# Altium project SysP18_Robi.PrjPcb
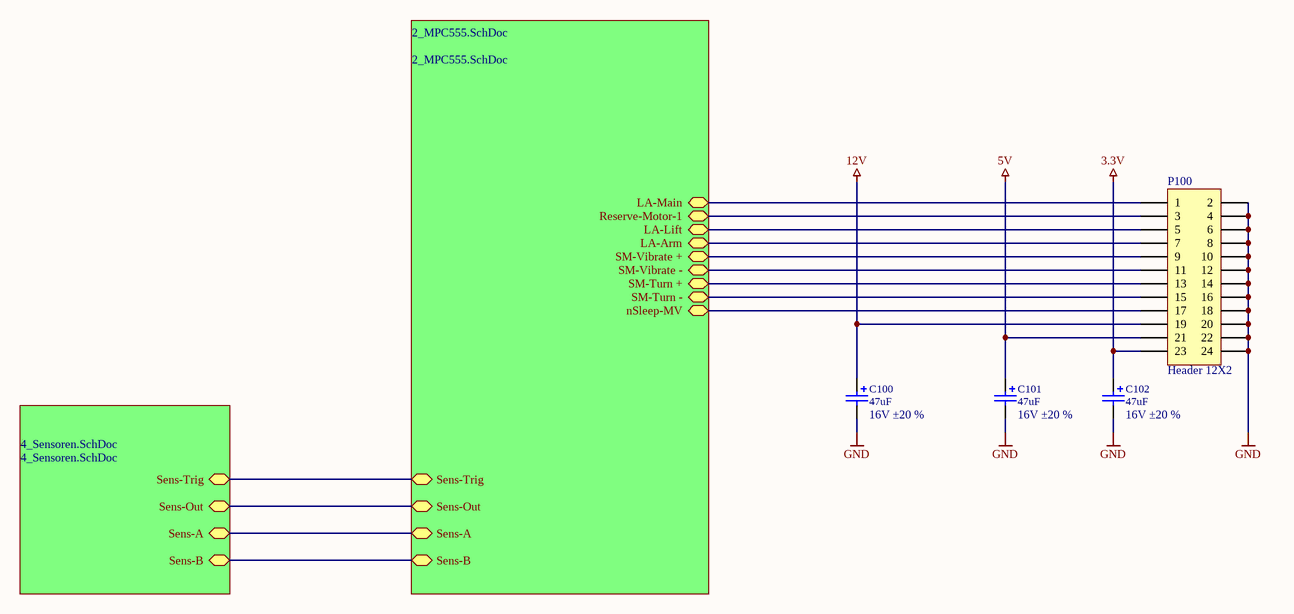
[diagram p0: TopSheet.schdoc]
3 sheets, 66 parts. Net scope: hierarchical (ports join the sheet entries above them; power ports are global).
Board file: SensorenUndMPC555.PcbDoc
Sheets:
  TopSheet.schdoc
    2_MPC555.SchDoc = 2_MPC555.SchDoc
    4_Sensoren.SchDoc = 4_Sensoren.SchDoc

## Sheet TopSheet.schdoc: Top Sheet und Verbindungstecker für Motoerntreiber
size A4; Organization1: Sciences of Technology Buchs; Size: A4

### Parts
C100  value 47uF  ValueAddon: 16V ±20 %  [CDE_CAP AVE CODE D_H]  (hidden comment: AVE476M16D16T-F)
C101  value 47uF  ValueAddon: 16V ±20 %  [CDE_CAP AVE CODE D_H]  (hidden comment: AVE476M16D16T-F)
C102  value 47uF  ValueAddon: 16V ±20 %  [CDE_CAP AVE CODE D_H]  (hidden comment: AVE476M16D16T-F)
P100  Header 12X2  [HDR2X12]

### Sub-sheets
2_MPC555.SchDoc = 2_MPC555.SchDoc: Sens-Trig, Sens-Out, Sens-A, Sens-B, LA-Main, Reserve-Motor-1, LA-Lift, LA-Arm, SM-Vibrate +, SM-Vibrate -, SM-Turn +, SM-Turn -, nSleep-MV
4_Sensoren.SchDoc = 4_Sensoren.SchDoc: Sens-Trig, Sens-Out, Sens-A, Sens-B

### Nets
3.3V: C102.1(Pos) P100.23
5V: C101.1(Pos) P100.21
12V: C100.1(Pos) P100.19
GND: C100.2(Neg) C101.2(Neg) C102.2(Neg) P100.2 P100.4 P100.6 P100.8 P100.10 P100.12 P100.14 P100.16 P100.18 P100.20 P100.22 P100.24
NetC402_1: sheet 2_MPC555.SchDoc/Sens-Trig, sheet 4_Sensoren.SchDoc/Sens-Trig
NetJ1_3: P100.1 ; sheet 2_MPC555.SchDoc/LA-Main
NetJ1_4: P100.13 ; sheet 2_MPC555.SchDoc/SM-Turn +
NetJ1_5: P100.15 ; sheet 2_MPC555.SchDoc/SM-Turn -
NetJ1_6: P100.5 ; sheet 2_MPC555.SchDoc/LA-Lift
NetJ1_7: P100.7 ; sheet 2_MPC555.SchDoc/LA-Arm
NetJ1_8: P100.9 ; sheet 2_MPC555.SchDoc/SM-Vibrate +
NetJ1_9: P100.11 ; sheet 2_MPC555.SchDoc/SM-Vibrate -
NetJ1_11: P100.3 ; sheet 2_MPC555.SchDoc/Reserve-Motor-1
NetJ1_35: sheet 2_MPC555.SchDoc/Sens-Out, sheet 4_Sensoren.SchDoc/Sens-Out
NetJ1_61: P100.17 ; sheet 2_MPC555.SchDoc/nSleep-MV
NetJ1_80: sheet 2_MPC555.SchDoc/Sens-A, sheet 4_Sensoren.SchDoc/Sens-A
NetJ1_81: sheet 2_MPC555.SchDoc/Sens-B, sheet 4_Sensoren.SchDoc/Sens-B

### Notes on the sheet
- Title:
- Description:
- Size:
- Date:
- Name:
- Number:
- Time:
- Revision:
- Sheet
- Checked:
- of
- File:

### Library data of the parts
C100-C102 = ELKO 47uF 16V: ELKO, 47uF, 16V, CDE_AVE476M16D16T-F_AVE CODE D; Manufacturer: Cornell Dubilier; #Class: PASSIVE; #ClassSub: CAPACITOR; RefFootprint: CDE_CAP AVE CODE D; Distributor PartNr: 598-AVE476M16D16T-F; Distributor: Mouser; Published: 20121220; Publisher: Stefan Ursella, M.Eng; ComponentLink1Description: Manufacturer Link; ComponentLink2Description: Datasheet; ComponentLink2URL: http://www.cde.com/catalogs/AVE.pdf; ComponentLink3Description: Packaging Specification; Manufacturer PartNr: AVE476M16D16T-F; RefFileFOO: *; RefFileSCH: *; RefSchema: CDE_AVE476M16D16T-F_AVE CODE D; ClassName: Connect_Full
P100 = Header 12X2: Header, 12-Pin, Dual row; LatestRevisionDate: 17-Jul-2002; LatestRevisionNote: Re-released for DXP Platform.; Publisher: Altium Limited

## Sheet 2_MPC555.SchDoc: Schema MPC 555 und Diverses
size A4; CheckedBy: Falk Kyburz; Author: Luzian Weber; Organization1: Sciences of Technology Buchs; Size: A4
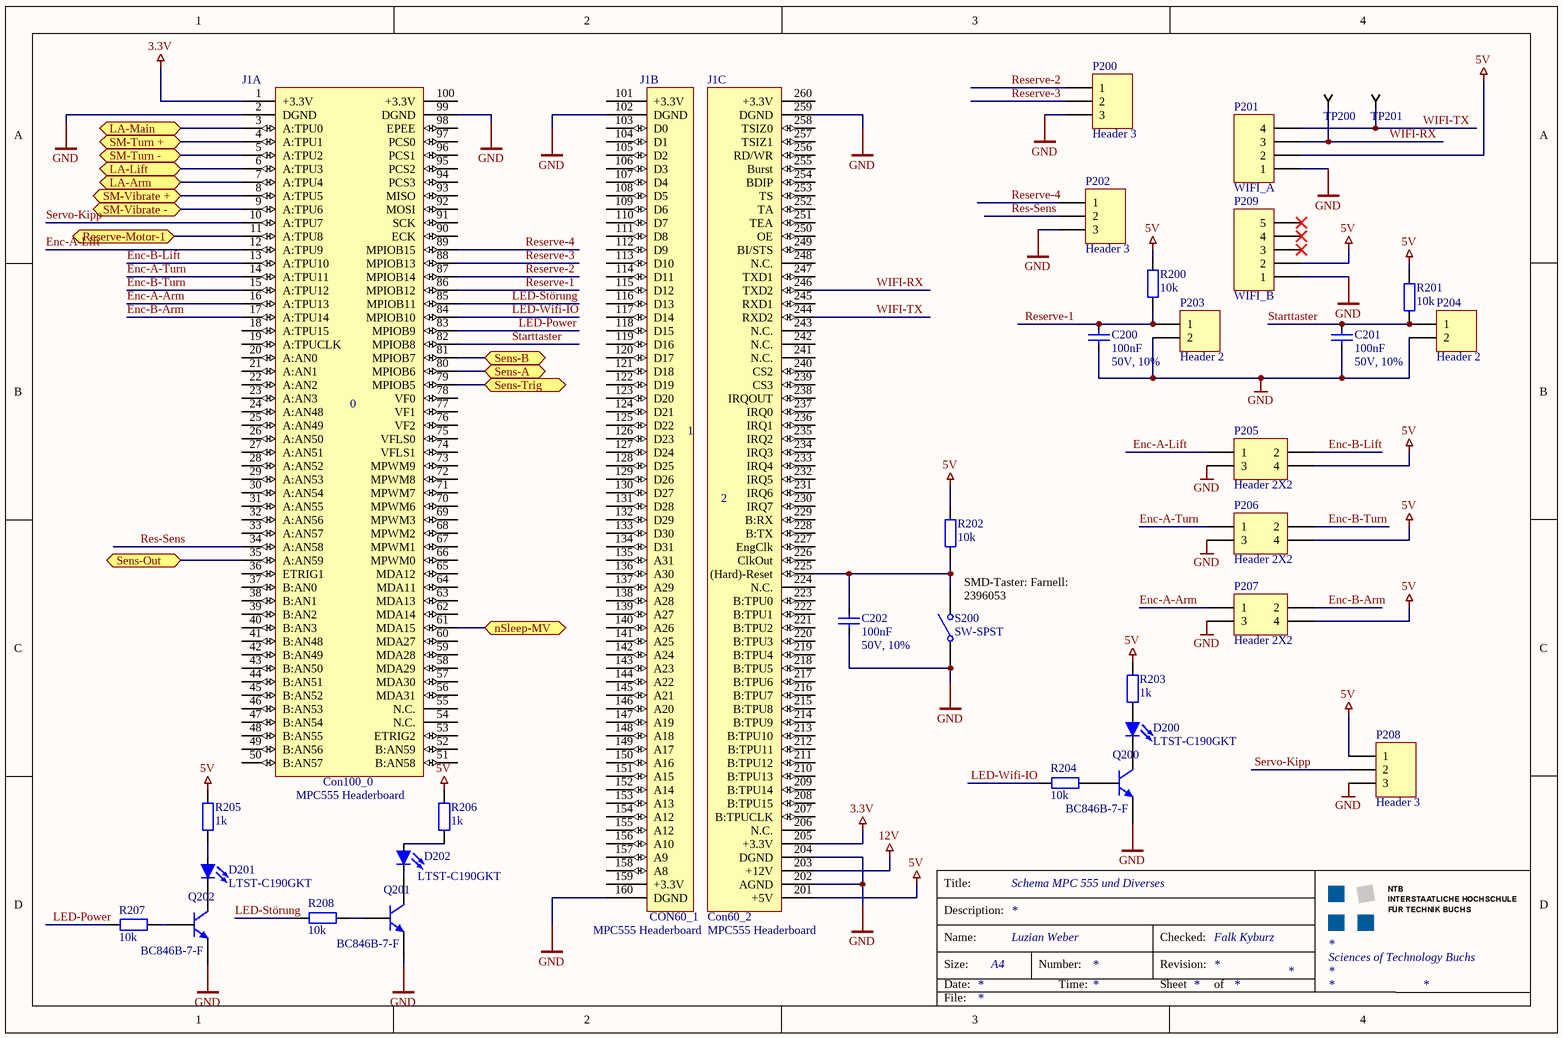
[diagram p1: 2_MPC555.SchDoc]

### Parts
C200  100nF  ValAddon: 50V, 10%  [CAP-0805[2012]]
C201  100nF  ValAddon: 50V, 10%  [CAP-0805[2012]]
C202  100nF  ValAddon: 50V, 10%  [CAP-0805[2012]]
D200  LTST-C190GKT  [LED 0603 green]
D201  LTST-C190GKT  [LED 0603 green]
D202  LTST-C190GKT  [LED 0603 green]
J1  MPC555 Headerboard  [MPC555 Headerboard THT]  (parts A,B,C of 3)
P200  Header 3  [HDR1X3]
P201  WIFI_A  [HDR1X4]
P202  Header 3  [HDR1X3]
P203  Header 2  [HDR1X2]
P204  Header 2  [HDR1X2]
P205  Header 2X2  [HDR2X2]
P206  Header 2X2  [HDR2X2]
P207  Header 2X2  [HDR2X2]
P208  Header 3  [HDR1X3]
P209  WIFI_B  [HDR1X5]
Q200  BC846B-7-F  [SOT-23]
Q201  BC846B-7-F  [SOT-23]
Q202  BC846B-7-F  [SOT-23]
R200  10k  [RES-0805[2012]]
R201  10k  [RES-0805[2012]]
R202  10k  [RES-0805[2012]]
R203  1k  [RES-0805[2012]]
R204  10k  [RES-0805[2012]]
R205  1k  [RES-0805[2012]]
R206  1k  [RES-0805[2012]]
R207  10k  [RES-0805[2012]]
R208  10k  [RES-0805[2012]]
S200  SW-SPST  [B3SE-1002P]
TP200  Testpoint SMD 1206  [TP-SMD-1206]  (value not drawn)  (no BOM)
TP201  Testpoint SMD 1206  [TP-SMD-1206]  (value not drawn)  (no BOM)

### Ports
LA-Arm, LA-Lift, LA-Main, nSleep-MV, Reserve-Motor-1, Sens-A, Sens-B, Sens-Out, Sens-Trig, SM-Turn +, SM-Turn -, SM-Vibrate +, SM-Vibrate -

### Nets
3.3V: J1.1(+3.3V) J1.205(+3.3V)
5V: J1.201(+5V) P201.2 P205.4 P206.4 P207.4 P208.1 P209.2 R200.2 R201.2 R202.2 R203.2 R205.2 R206.2
12V: J1.203(+12V)
GND: C200.1(Pos) C201.1(Pos) C202.1(Pos) J1.2(DGND) J1.99(DGND) J1.102(DGND) J1.160(DGND) J1.202(AGND) J1.204(DGND) J1.259(DGND) P200.3 P201.1 P202.3 P203.2 P204.2 P205.3 P206.3 P207.3 P208.3 P209.1 Q200.2(E) Q201.2(E) Q202.2(E) S200.1(COMMON)
Enc-A-Arm: J1.16(A:TPU13) P207.1
Enc-A-Lift: J1.12(A:TPU9) P205.1
Enc-A-Turn: J1.14(A:TPU11) P206.1
Enc-B-Arm: J1.17(A:TPU14) P207.2
Enc-B-Lift: J1.13(A:TPU10) P205.2
Enc-B-Turn: J1.15(A:TPU12) P206.2
LED-Power: J1.83(MPIOB9) R207.1
LED-Störung: J1.85(MPIOB11) R208.1
LED-Wifi-IO: J1.84(MPIOB10) R204.1
Res-Sens: J1.34(A:AN58) P202.2
Reserve-1: C200.2(Neg) J1.86(MPIOB12) P203.1 R200.1
Reserve-2: J1.87(MPIOB14) P200.1
Reserve-3: J1.88(MPIOB13) P200.2
Reserve-4: J1.89(MPIOB15) P202.1
Servo-Kipp: J1.10(A:TPU7) P208.2
Starttaster: C201.2(Neg) J1.82(MPIOB8) P204.1 R201.1
WIFI-RX: J1.246(TXD2) P201.3 TP200.1
WIFI-TX: J1.244(RXD2) P201.4 TP201.1
NetC202_2: C202.2(Neg) J1.225((Hard)-Reset) R202.1 S200.2(NO)
NetC402_1: J1.79(MPIOB5) ; port Sens-Trig
NetD200_1: D200.1(K) Q200.3(C)
NetD200_2: D200.2(A) R203.1
NetD201_1: D201.1(K) Q202.3(C)
NetD201_2: D201.2(A) R205.1
NetD202_1: D202.1(K) Q201.3(C)
NetD202_2: D202.2(A) R206.1
NetJ1_3: J1.3(A:TPU0) ; port LA-Main
NetJ1_4: J1.4(A:TPU1) ; port SM-Turn +
NetJ1_5: J1.5(A:TPU2) ; port SM-Turn -
NetJ1_6: J1.6(A:TPU3) ; port LA-Lift
NetJ1_7: J1.7(A:TPU4) ; port LA-Arm
NetJ1_8: J1.8(A:TPU5) ; port SM-Vibrate +
NetJ1_9: J1.9(A:TPU6) ; port SM-Vibrate -
NetJ1_11: J1.11(A:TPU8) ; port Reserve-Motor-1
NetJ1_35: J1.35(A:AN59) ; port Sens-Out
NetJ1_61: J1.61(MDA15) ; port nSleep-MV
NetJ1_80: J1.80(MPIOB6) ; port Sens-A
NetJ1_81: J1.81(MPIOB7) ; port Sens-B
NetQ200_1: Q200.1(B) R204.2
NetQ201_1: Q201.1(B) R208.2
NetQ202_1: Q202.1(B) R207.2

Not connected (* = marked no-connect by the designer): J1 18(A:TPU15) 19(A:TPUCLK) 20(A:AN0) 21(A:AN1) 22(A:AN2) 23(A:AN3) 24(A:AN48) 25(A:AN49) 26(A:AN50) 27(A:AN51) 28(A:AN52) 29(A:AN53) 30(A:AN54) 31(A:AN55) 32(A:AN56) 33(A:AN57) 36(ETRIG1) 37(B:AN0) 38(B:AN1) 39(B:AN2) 40(B:AN3) 41(B:AN48) 42(B:AN49) 43(B:AN50) 44(B:AN51) 45(B:AN52) 46(B:AN53) 47(B:AN54) 48(B:AN55) 49(B:AN56) 50(B:AN57) 51(B:AN58) 52(B:AN59) 53(ETRIG2) 54(N.C.) 55(N.C.) 56(MDA31) 57(MDA30) 58(MDA29) 59(MDA28) 60(MDA27) 62(MDA14) 63(MDA13) 64(MDA11) 65(MDA12) 66(MPWM0) 67(MPWM1) 68(MPWM2) 69(MPWM3) 70(MPWM6) 71(MPWM7) 72(MPWM8) 73(MPWM9) 74(VFLS1) 75(VFLS0) 76(VF2) 77(VF1) 78(VF0) 90(ECK) 91(SCK) 92(MOSI) 93(MISO) 94(PCS3) 95(PCS2) 96(PCS1) 97(PCS0) 98(EPEE) 100(+3.3V) 101(+3.3V) 103(D0) 104(D1) 105(D2) 106(D3) 107(D4) 108(D5) 109(D6) 110(D7) 111(D8) 112(D9) 113(D10) 114(D11) 115(D12) 116(D13) 117(D14) 118(D15) 119(D16) 120(D17) 121(D18) 122(D19) 123(D20) 124(D21) 125(D22) 126(D23) 127(D24) 128(D25) 129(D26) 130(D27) 131(D28) 132(D29) 133(D30) 134(D31) 135(A31) 136(A30) 137(A29) 138(A28) 139(A27) 140(A26) 141(A25) 142(A24) 143(A23) 144(A22) 145(A21) 146(A20) 147(A19) 148(A18) 149(A17) 150(A16) 151(A15) 152(A14) 153(A13) 154(A12) 155(A12) 156(A10) 157(A9) 158(A8) 159(+3.3V) 206(N.C.) 207(B:TPUCLK) 208(B:TPU15) 209(B:TPU14) 210(B:TPU13) 211(B:TPU12) 212(B:TPU11) 213(B:TPU10) 214(B:TPU9) 215(B:TPU8) 216(B:TPU7) 217(B:TPU6) 218(B:TPU5) 219(B:TPU4) 220(B:TPU3) 221(B:TPU2) 222(B:TPU1) 223(B:TPU0) 224(N.C.) 226(ClkOut) 227(EngClk) 228(B:TX) 229(B:RX) 230(IRQ7) 231(IRQ6) 232(IRQ5) 233(IRQ4) 234(IRQ3) 235(IRQ2) 236(IRQ1) 237(IRQ0) 238(IRQOUT) 239(CS3) 240(CS2) 241(N.C.) 242(N.C.) 243(N.C.) 245(RXD1) 247(TXD1) 248(N.C.) 249(BI/STS) 250(OE) 251(TEA) 252(TA) 253(TS) 254(BDIP) 255(Burst) 256(RD/WR) 257(TSIZ1) 258(TSIZ0) 260(+3.3V); P209 3* 4* 5*

### Notes on the sheet
- (near S200) SMD-Taster: Farnell: 2396053
- Title:
- Description:
- Size:
- Date:
- Name:
- Number:
- Time:
- Revision:
- Sheet
- Checked:
- of
- File:
- (in symbol MPC555 Headerboard, part A) 0; Con100_0
- (in symbol MPC555 Headerboard, part B) CON60_1
- (in symbol MPC555 Headerboard, part C) Con60_2

### Library data of the parts
C200-C202 = MLCC 0805 100n 50V: 100n 50V X7R MLCC 0805 (1608 Metric); Tolerance: 10%; Case-EIA: 0803; Case-Metric: 2013; Rated Voltage: 50V; Temperature Characteristics EIA: X7R; Temperature Range EIA: -55C/+125C; Value: 100nF
D200-D202 = LED Green: LED SMD 0603 green 6mcd; Forward Current: 30mA; Forward Voltage: 2.1V; Spectrum: 565nm; Color: green; ComponentLink1Description: Datasheet LTST-C190GKT; ComponentLink1URL: V:\Diodes\Lite-On-LTST-C190GKT.pdf
J1 = MPC555 Headerboard: NTB MPC555 Headerboard
P200 P202 P208 = Header 3: Header, 3-Pin; LatestRevisionDate: 17-Jul-2002; LatestRevisionNote: Re-released for DXP Platform.; Publisher: Altium Limited
P201 = Header 4: Header, 4-Pin; LatestRevisionDate: 17-Jul-2002; LatestRevisionNote: Re-released for DXP Platform.; Publisher: Altium Limited
P203 P204 = Header 2: Header, 2-Pin; LatestRevisionDate: 17-Jul-2002; LatestRevisionNote: Re-released for DXP Platform.; Publisher: Altium Limited
P205-P207 = Header 2X2: Header, 2-Pin, Dual row; LatestRevisionDate: 17-Jul-2002; LatestRevisionNote: Re-released for DXP Platform.; Publisher: Altium Limited
P209 = Header 5: Header, 5-Pin; LatestRevisionDate: 17-Jul-2002; LatestRevisionNote: Re-released for DXP Platform.; Publisher: Altium Limited
Q200-Q202 = BC846B-SOT23: NPN General-purpose Transistor; Manufacturer: DIODES INC; #Class: SEMICONDUCTOR-TRANSISTOR; #ClassSub: BJT-NPN; RefFootprint: DIODS_SOT23_1B2E3C_3_H; RefSchema: DIODS_BC846B-7-F_SOT23; Published: 17-Sep-2003; Publisher: Altium Limited; ComponentLink1Description: Manufacturer Link; ComponentLink1URL: http://www.diodes.com/products/catalog/detail.php?item-id=6689&popup=datasheet; ComponentLink2Description: Datasheet; ComponentLink2URL: http://www.diodes.com/datasheets/ds11108.pdf; ComponentLink3Description: Packaging Specification; ComponentLink3URL: http://www.diodes.com/datasheets/ap02001.pdf; Distributor: Farnell; Manufacturer PartNr: BC846B-7-F; Distributor PartNr: 1773617; Status: nLager; RefFileFOO: *; RefFileSCH: *
R200-R208 = RES 0805: 0805 (2013 Metric) 1/10 W 10K 1 Thick Film Chip Resistor; Power: 1/10 W; Case-EIA: 0805; Case-Metric: 2013; Tolerance: 1%; Temp. Coefficent: ±100ppm; Technology: SMT; Value: 10k
S200 = SW-SPST: Single-Pole, Single-Throw Switch; Published: 24-Mar-1999; LatestRevisionDate: 17-Jul-2002; LatestRevisionNote: Re-released for DXP Platform.; PackageReference: SPST-2; Publisher: Altium Limited; PackageDescription: Switch; 2 Leads
TP200 TP201 = Testpoint SMD 1206: Testpoint xSmall; Type: Standard (No BOM)

## Sheet 4_Sensoren.SchDoc: Schema Sensoren
size A4; CheckedBy: Falk Kyburz; Author: Luzian Weber; Organization1: Sciences of Technology Buchs; Size: A4
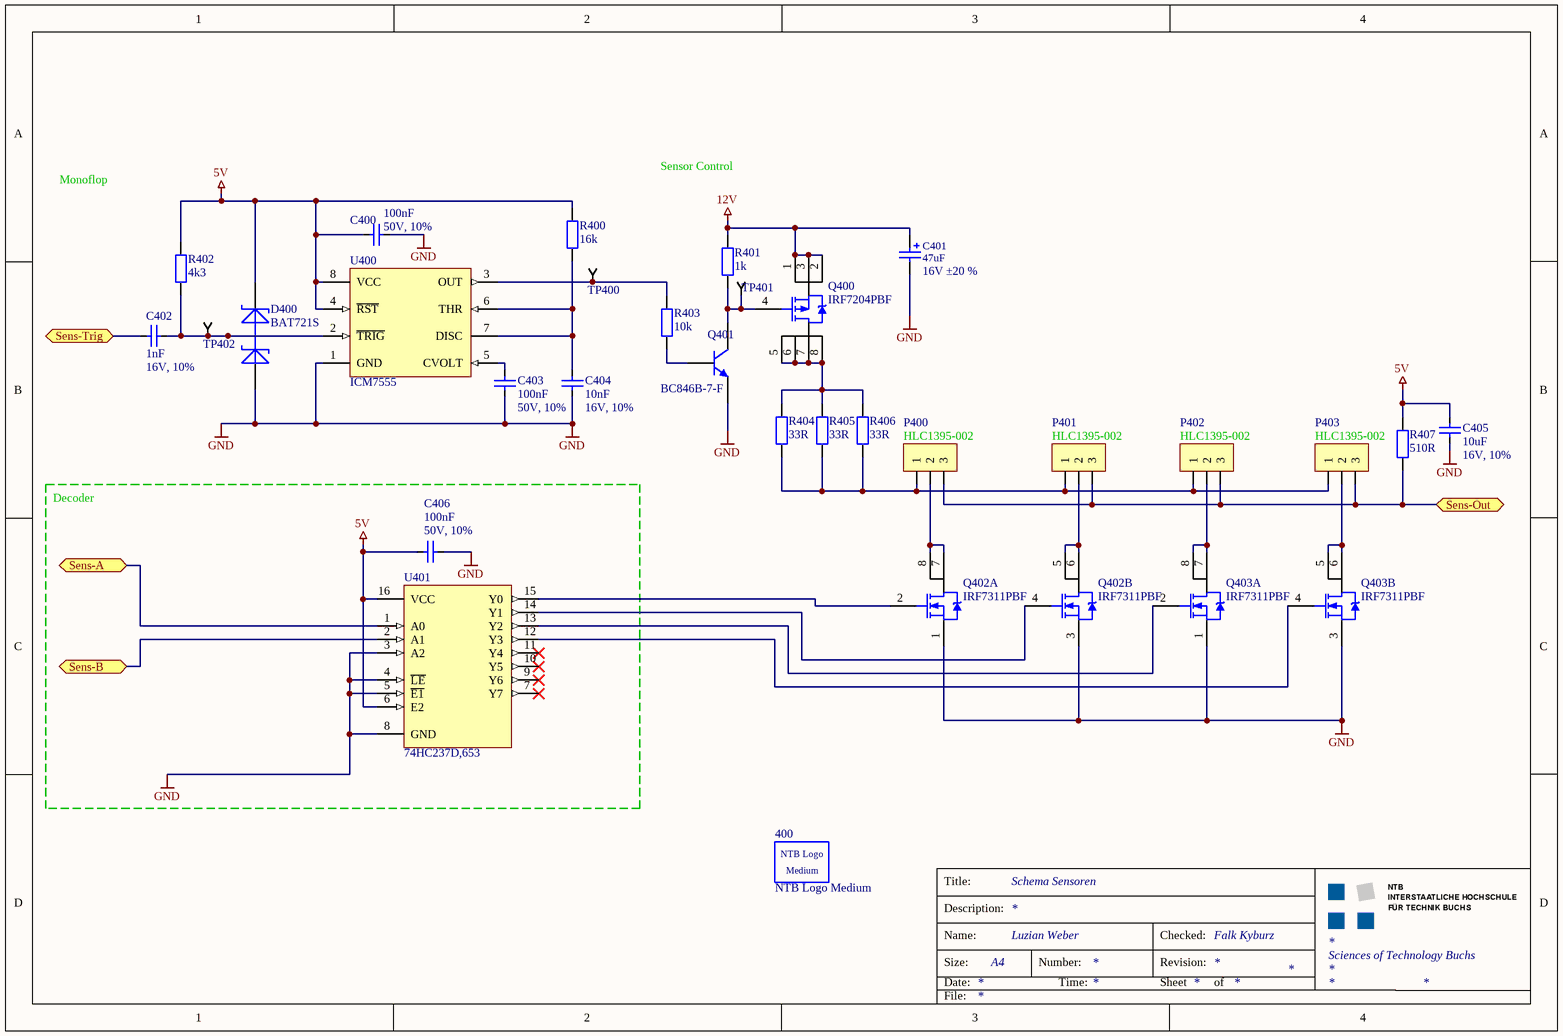
[diagram p2: 4_Sensoren.SchDoc]

### Parts
400  NTB Logo Medium  [NTB Logo Medium]
C400  100nF  ValAddon: 50V, 10%  [CAP-0805[2012]]
C401  value 47uF  ValueAddon: 16V ±20 %  [CDE_CAP AVE CODE D_H]  (hidden comment: AVE476M16D16T-F)
C402  1nF  ValueAddon: 16V, 10%  [CAP-0805[2012]]
C403  100nF  ValAddon: 50V, 10%  [CAP-0805[2012]]
C404  10nF  ValueAddon: 16V, 10%  [CAP-0805[2012]]
C405  10uF  ValAddon: 16V, 10%  [CAP-1206[3216]]
C406  100nF  ValAddon: 50V, 10%  [CAP-0805[2012]]
D400  BAT721S  [SOT-23]
P400  3 Pin Header Buchse  [3PIN HEADER SOCKET 2.54MM]  (value not drawn)
P401  3 Pin Header Buchse  [3PIN HEADER SOCKET 2.54MM]  (value not drawn)
P402  3 Pin Header Buchse  [3PIN HEADER SOCKET 2.54MM]  (value not drawn)
P403  3 Pin Header Buchse  [3PIN HEADER SOCKET 2.54MM]  (value not drawn)
Q400  IRF7204PBF  [SOIC-8]
Q401  BC846B-7-F  [SOT-23]
Q402  IRF7311PBF  [SOIC-8]  (parts A,B of 2)
Q403  IRF7311PBF  [SOIC-8]  (parts A,B of 2)
R400  16k  [RES-0805[2012]]
R401  1k  [RES-0805[2012]]
R402  4k3  [RES-0805[2012]]
R403  10k  [RES-0805[2012]]
R404  33R  [RES-0805[2012]]
R405  33R  [RES-0805[2012]]
R406  33R  [RES-0805[2012]]
R407  510R  [RES-0805[2012]]
TP400  Testpoint SMD 1206  [TP-SMD-1206]  (value not drawn)  (no BOM)
TP401  Testpoint SMD 1206  [TP-SMD-1206]  (value not drawn)  (no BOM)
TP402  Testpoint SMD 1206  [TP-SMD-1206]  (value not drawn)  (no BOM)
U400  ICM7555  [SOIC-8]
U401  74HC237D,653  [SOIC-16]

### Blocks framed on the sheet
Decoder: C406 U401

### Ports
Sens-A, Sens-B, Sens-Out, Sens-Trig

### Nets
5V: C400.1(Pos) C405.1(Pos) C406.1(Pos) D400.2(cathode2) R400.2 R402.2 R407.2 U400.4(~{RST}) U400.8(VCC) U401.6(E2) U401.16(VCC)
12V: C401.1(Pos) Q400.1(S) Q400.2(S) Q400.3(S) R401.2
GND: C400.2(Neg) C401.2(Neg) C403.2(Neg) C404.2(Neg) C405.2(Neg) C406.2(Neg) D400.1(Anode1) Q401.2(E) Q402.1(S) Q402.3(S) Q403.1(S) Q403.3(S) U400.1(GND) U401.3(A2) U401.4(~{LE}) U401.5(~{E1}) U401.8(GND)
NetC402_1: C402.1(Pos) ; port Sens-Trig
NetC402_2: C402.2(Neg) D400.3(Cathode1,_anode2) R402.1 TP402.1 U400.2(~{TRIG})
NetC403_1: C403.1(Pos) U400.5(CVOLT)
NetC404_1: C404.1(Pos) R400.1 U400.6(THR) U400.7(DISC)
NetJ1_35: P400.3 P401.3 P402.3 P403.3 R407.1 ; port Sens-Out
NetJ1_80: U401.1(A0) ; port Sens-A
NetJ1_81: U401.2(A1) ; port Sens-B
NetP400_1: P400.1 P401.1 P402.1 P403.1 R404.1 R405.1 R406.1
NetP400_2: P400.2 Q402.7(D) Q402.8(D)
NetP401_2: P401.2 Q402.5(D) Q402.6(D)
NetP402_2: P402.2 Q403.7(D) Q403.8(D)
NetP403_2: P403.2 Q403.5(D) Q403.6(D)
NetQ400_4: Q400.4(G) Q401.3(C) R401.1 TP401.1
NetQ400_5: Q400.5(D) Q400.6(D) Q400.7(D) Q400.8(D) R404.2 R405.2 R406.2
NetQ401_1: Q401.1(B) R403.2
NetQ402_2: Q402.2(G) U401.15(Y0)
NetQ402_4: Q402.4(G) U401.14(Y1)
NetQ403_2: Q403.2(G) U401.13(Y2)
NetQ403_4: Q403.4(G) U401.12(Y3)
NetR403_1: R403.1 TP400.1 U400.3(OUT)

Not connected (* = marked no-connect by the designer): U401 7(Y7)* 9(Y6)* 10(Y5)* 11(Y4)*

### Notes on the sheet
- Sensor Control
- Monoflop
- HLC1395-002
- (near P401) HLC1395-002
- (near P402) HLC1395-002
- Title:
- Description:
- Size:
- Date:
- Name:
- Number:
- Time:
- Revision:
- Sheet
- Checked:
- of
- File:
- (in symbol NTB Logo Medium) NTB Logo; Medium

### Library data of the parts
C400 C403 C406 = MLCC 0805 100n 50V: as C200 on sheet 2_MPC555; Rated Voltage: 50V; Temperature Characteristics EIA: X7R; Temperature Range EIA: -55C/+125C; Value: 100nF
C401 = ELKO 47uF 16V: as C100 on sheet TopSheet; Distributor PartNr: 598-AVE476M16D16T-F; Distributor: Mouser; Published: 20121220; Publisher: Stefan Ursella, M.Eng; ComponentLink1Description: Manufacturer Link; ComponentLink2Description: Datasheet; ComponentLink2URL: http://www.cde.com/catalogs/AVE.pdf; ComponentLink3Description: Packaging Specification; Manufacturer PartNr: AVE476M16D16T-F; RefFileFOO: *; RefFileSCH: *; RefSchema: CDE_AVE476M16D16T-F_AVE CODE D; ClassName: Connect_Full
C402 = MLCC 0805 1n 16V: MLCC - SMD/SMT 0805 1000pF 16V C0G 10%; Manufacturer: Vishay; Manufacturer PartNr: VJ0805A102KXJPW1BC; RefFootprint: Gen_0805_H; RefSchema: Cap_1nF; #Class: *; #SubClass: *; Published: 18.12.14; Publisher: SCLM; RefFileFOO: *; RefFileSCH: *; ComponentLink1Description: Manufacturer Link; ComponentLink1URL: http://www.vishay.com/product?docid=28548; ComponentLink2Description: Datasheet; ComponentLink2URL: http://www.vishay.com/docs/28548/vjw1bcbascomseries.pdf; Supplier 1: Mouser; Supplier Part Number 1: 77-VJ0805A102KXJPBC; Status: Lager?; Value: 1nF
C404 = MLCC 0805 10n 16V: 10n 16V X7R MLCC 0805; Manufacturer: AVX; Manufacturer PartNr: 0805YC103KAT2A; #Class: *; #SubClass: *; Published: 09.01.15; Publisher: SCLM; RefFootprint: *; RefFileFOO: *; RefFileSCH: *; RefSchema: *; ComponentLink1Description: Manufacturer Link; ComponentLink1URL: http://www.avx.com/prodinfo_productdetail.asp?I=45&K=search&C=&word=0805YC103KAT2A&form=number&Number=; ComponentLink2Description: Datasheet; ComponentLink2URL: http://www.farnell.com/datasheets/1679506.pdf; Status: LAger?; Value: 10nF
C405 = MLCC 1206 10u 16V: 10u 16V X7R MLCC 1206 (3016 Metric); Rated Voltage: 10V; Tolerance: 10%; Case-EIA: 1206; Case-Metric: 3216; Temperature Characteristics EIA: X7R; Temperature Range EIA: -55C/+125C; Value: 10uF
D400 = BAT721S-SOT23: NXP  BAT721S  SCHOTTKY-DIODE, 2FACH; RefFootprint: CDE_CAP AVE CODE D; RefSchema: CDE_AVE476M16D16T-F_AVE CODE D; ComponentLink1Description: Manufacturer Link; ComponentLink1URL: http://www.nxp.com/search?q=%09bat721s&type=keyword&rows=10; ComponentLink2Description: Datasheet; ComponentLink2URL: http://www.farnell.com/datasheets/453891.pdf; ComponentLink3Description: Packaging Specification; Distributor: Farnell; Distributor PartNr: 1081200; Manufacturer: NXP; Manufacturer PartNr: BAT721S; Published: 20150612; Publisher: SCNP
P400-P403 = 3 Pin Header Buchse: 3 Pin Header 2.54mm Buchse; #Class: *; #SubClass: *; Manufacturer: *; Manufacturer PartNr: *; ComponentLink1Description: Manufacturer Link; ComponentLink1URL: *; ComponentLink2Description: *; ComponentLink2URL: *
Q400 = IRF7204: High Power P-Kanal Mosfet; Manufacturer: International Rectifiers; RefFootprint: IRF_SO8_H; RefSchema: IRF_IRF7204_SO-8; Published: 8-Jun-2000; Publisher: Altium Limited; ComponentLink1Description: Manufacturer Link; ComponentLink1URL: http://www.irf.com/; ComponentLink2Description: Datasheet; ComponentLink2URL: http://www.irf.com/product-info/datasheets/data/irf7204.pdf; Manufacturer PartNr: IRF7204PBF; Supplier Part Number 1: 9103350; Supplier 1: Farnell; RefFileFOO: *; RefFileSCH: *; Status: nLager; #Class: *; #SubClass: *
Q401 = BC846B-SOT23: as Q200 on sheet 2_MPC555; Published: 17-Sep-2003; Publisher: Altium Limited; ComponentLink1Description: Manufacturer Link; ComponentLink1URL: http://www.diodes.com/products/catalog/detail.php?item-id=6689&popup=datasheet; ComponentLink2Description: Datasheet; ComponentLink2URL: http://www.diodes.com/datasheets/ds11108.pdf; ComponentLink3Description: Packaging Specification; ComponentLink3URL: http://www.diodes.com/datasheets/ap02001.pdf; Distributor: Farnell; Manufacturer PartNr: BC846B-7-F; Distributor PartNr: 1773617; Status: nLager; RefFileFOO: *; RefFileSCH: *
Q402 Q403 = IRF7311: Dual N-Kanal Mosfet; Manufacturer: International Rectifier; RefFootprint: IRF_SO8_H; RefSchema: IRF_IRF7311_SO-8; Published: 8-Jun-2000; Publisher: Altium Limited; ComponentLink1Description: Manufacturer Link; ComponentLink1URL: http://www.irf.com/; ComponentLink2Description: Datasheet; ComponentLink2URL: http://www.irf.com/product-info/datasheets/data/irf7311.pdf; Supplier 1: Farnell; Manufacturer PartNr: IRF7311PBF; Supplier Part Number 1: 1013364; RefFileFOO: *; RefFileSCH: *; #Class: *; #SubClass: *; Status: nLager
R400-R407 = RES 0805: as R200 on sheet 2_MPC555; Technology: SMT
  R400: Value: 16k
  R401: Value: 1k
  R402: Value: 4k3
  R403-R406: Value: 10k
  R407: Value: 510R
TP400-TP402 = Testpoint SMD 1206: Testpoint xSmall; Type: Standard (No BOM)
U400 = ICM7555-SOIC8: General purpose CMOS timer; Manufacturer: National Semiconductor; #Class: Analog; #SubClass: Timer Circuit; RefFootprint: NXP_SO8(SOT96-1)_H; RefSchema: NXP_ICM7555_SO-8; Published: 15/04/2002; Publisher: Altium Hobart Technology Centre; ComponentLink1Description: Datasheet; ComponentLink2Description: Distributor; ComponentLink1URL: http://www.datasheetcatalog.org/datasheet/intersil/fn2867.pdf; ComponentLink2URL: https://www.distrelec.ch/ishopWebFront/catalog/product.do/para/node/is/acaaabaaacaf/and/highlightNode/is/640145/and/id/is/01/and/series/is/1.html; Supplier 1: Mouser Electronics; Manufacturer PartNr: ICM7555; Supplier Part Number 1: 771-ICM7555; RefFileFOO: *; RefFileSCH: *; Status: nLager
U401 = 74HC237D-SOIC16: 3-to-8 line decoder, demultiplexer, NXP, SO16; RefFootprint: NXP_SO16(SOT109-1)_H; RefSchema: NXP_74HC237D_SO-16; Supplier 1: Mouser Electronics; Supplier Part Number 1: 771-HC237D653; Manufacturer PartNr: 74HC237D,653; Status: nLager; #Class: *; #SubClass: *; Manufacturer: NXP; Published: 28.11.2014; Publisher: SCLM; RefFileFOO: *; RefFileSCH: *; ComponentLink1Description: Manufacturer Link; ComponentLink1URL: http://www.nxp.com/products/logic/decoders_demultiplexers/74HC237D.html; ComponentLink2Description: Datasheet; ComponentLink2URL: http://www.nxp.com/documents/data_sheet/74HC237.pdf

## Nets that join several sheets
3.3V: TopSheet (C102.1 P100.23), 2_MPC555 (J1.1 J1.205)
5V: TopSheet (C101.1 P100.21), 2_MPC555 (13 pins), 4_Sensoren (11 pins)
12V: TopSheet (C100.1 P100.19), 2_MPC555 (J1.203), 4_Sensoren (5 pins)
GND: TopSheet (15 pins), 2_MPC555 (24 pins), 4_Sensoren (17 pins)
NetC402_1: 2_MPC555 (J1.79), 4_Sensoren (C402.1)
NetJ1_3: TopSheet (P100.1), 2_MPC555 (J1.3)
NetJ1_4: TopSheet (P100.13), 2_MPC555 (J1.4)
NetJ1_5: TopSheet (P100.15), 2_MPC555 (J1.5)
NetJ1_6: TopSheet (P100.5), 2_MPC555 (J1.6)
NetJ1_7: TopSheet (P100.7), 2_MPC555 (J1.7)
NetJ1_8: TopSheet (P100.9), 2_MPC555 (J1.8)
NetJ1_9: TopSheet (P100.11), 2_MPC555 (J1.9)
NetJ1_11: TopSheet (P100.3), 2_MPC555 (J1.11)
NetJ1_35: 2_MPC555 (J1.35), 4_Sensoren (5 pins)
NetJ1_61: TopSheet (P100.17), 2_MPC555 (J1.61)
NetJ1_80: 2_MPC555 (J1.80), 4_Sensoren (U401.1)
NetJ1_81: 2_MPC555 (J1.81), 4_Sensoren (U401.2)